# Altium project Merigold.PrjPcb
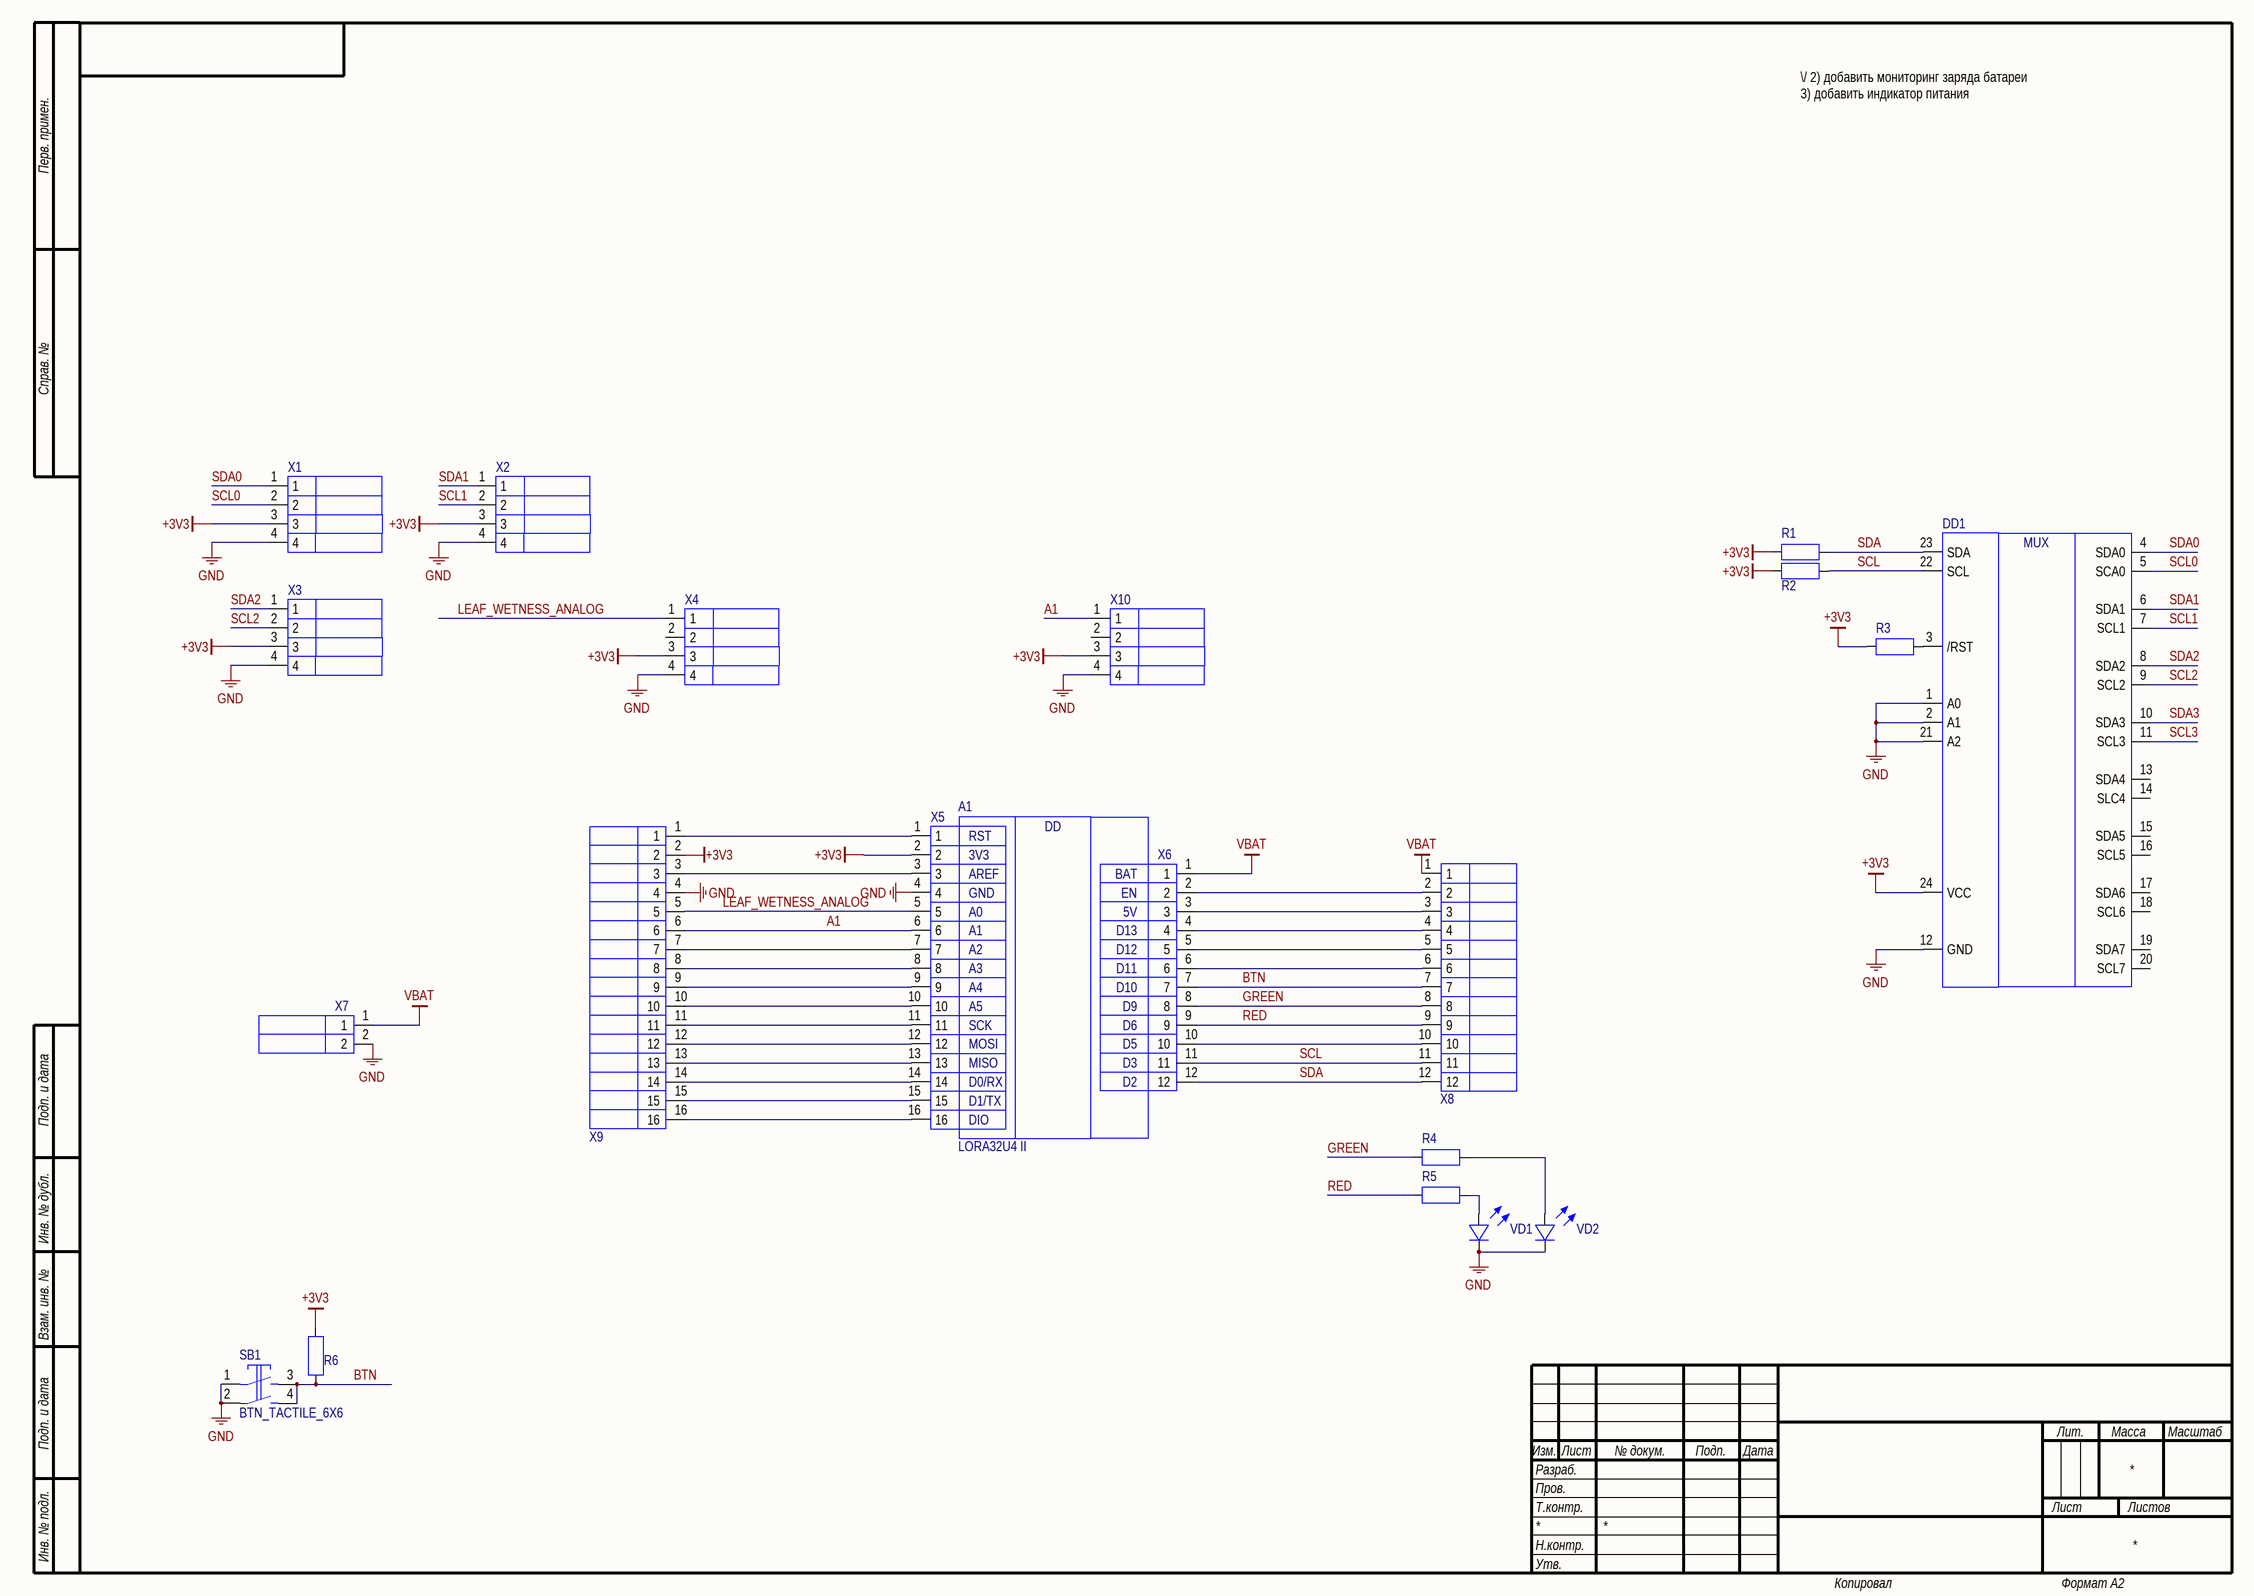
[diagram p0: merigold.SchDoc]
1 sheet, 21 parts. Net scope: global (net labels, ports and power ports of the same name join across sheets).
Board file: merigold_v3.PcbDoc

## Sheet merigold.SchDoc
size 594 x 420 mm; PageSetup: Record=PageOptions|CenterHorizontal=True|CenterVertical=True|PrintScale=0.94|XCorrection=1.00|YCorrection=1.00|PrintKind=1|BorderSize=5000000|LeftOffset=0|BottomOffset=0|Orientation=1|PaperLength=1000|PaperWidth=1000|Scale=100|PaperSource=7|PrintQuality=-4|MediaType=1|DitherType=10|PaperKind=A4|PrintScaleMode=1; DecimalNumber: Децимальный номер; HeadOfSector: Нач. сектора; MainDevice: Перв.примен.; Name: Наименование

### Parts
A1  LORA32U4 II  [LORA32U4 II]
DD1  TCA9548A  [TSOP65P640X120-24M]  (value not drawn)
R1  10K1206  [RESC3216X07N/1206]  (value not drawn)
R2  10K1206  [RESC3216X07N/1206]  (value not drawn)
R3  10K1206  [RESC3216X07N/1206]  (value not drawn)
R4  200R1206  [RESC3216X07N/1206]  (value not drawn)
R5  200R1206  [RESC3216X07N/1206]  (value not drawn)
R6  10K1206  [RESC3216X07N/1206]  (value not drawn)
SB1  BTN_TACTILE_6X6  [BTN_TACTILE_6X6]
VD1  LED_SSL-LX5093GD-TR26  [LED500]  (value not drawn)
VD2  LED_SSL-LX5093GD-TR26  [LED500]  (value not drawn)
X1  MOLEX_0397000904  [MOLEX_0397000904]  (value not drawn)
X2  MOLEX_0397000904  [MOLEX_0397000904]  (value not drawn)
X3  MOLEX_0397000904  [MOLEX_0397000904]  (value not drawn)
X4  MOLEX_0397000904  [MOLEX_0397000904]  (value not drawn)
X5  PLS_16_FEMALE  [PLS_16_FEMALE]  (value not drawn)
X6  PLS_12_FEMALE  [PLS_12_FEMALE]  (value not drawn)
X7  2EDGV-5.0-02P  [2EDGV-5.0-02P]  (value not drawn)
X8  PLS_12_FEMALE  [PLS_12_FEMALE]  (value not drawn)
X9  PLS_16_FEMALE  [PLS_16_FEMALE]  (value not drawn)
X10  MOLEX_0397000904  [MOLEX_0397000904]  (value not drawn)

### Nets
+3V3: DD1.24(VCC) R1.2 R2.2 R3.2 R6.2 X1.3 X2.3 X3.3 X4.3 X5.2 X9.2 X10.3
GND: DD1.1(A0) DD1.2(A1) DD1.12(GND) DD1.21(A2) SB1.1 SB1.2 VD1.K VD2.K X1.4 X2.4 X3.4 X4.4 X5.4 X7.2 X9.4 X10.4
VBAT: X6.1 X7.1 X8.1
A1: X5.6 X9.6 X10.1
BTN: R6.1 SB1.3 SB1.4 X6.7 X8.7
GREEN: R4.2 X6.8 X8.8
LEAF_WETNESS_ANALOG: X4.1 X5.5 X9.5
RED: R5.2 X6.9 X8.9
SCL: DD1.22(SCL) R2.1 X6.11 X8.11
SCL0: DD1.5(SCA0) X1.2
SCL1: DD1.7(SCL1) X2.2
SCL2: DD1.9(SCL2) X3.2
SCL3: DD1.11(SCL3)
SDA: DD1.23(SDA) R1.1 X6.12 X8.12
SDA0: DD1.4(SDA0) X1.1
SDA1: DD1.6(SDA1) X2.1
SDA2: DD1.8(SDA2) X3.1
SDA3: DD1.10(SDA3)
NetDD1_3: DD1.3(/RST) R3.1
NetR4_1: R4.1 VD2.A
NetR5_1: R5.1 VD1.A
NetX5_1: X5.1 X9.1
NetX5_3: X5.3 X9.3
NetX5_7: X5.7 X9.7
NetX5_8: X5.8 X9.8
NetX5_9: X5.9 X9.9
NetX5_10: X5.10 X9.10
NetX5_11: X5.11 X9.11
NetX5_12: X5.12 X9.12
NetX5_13: X5.13 X9.13
NetX5_14: X5.14 X9.14
NetX5_15: X5.15 X9.15
NetX5_16: X5.16 X9.16
NetX6_2: X6.2 X8.2
NetX6_3: X6.3 X8.3
NetX6_4: X6.4 X8.4
NetX6_5: X6.5 X8.5
NetX6_6: X6.6 X8.6
NetX6_10: X6.10 X8.10

Not connected (* = marked no-connect by the designer): DD1 13(SDA4) 14(SLC4) 15(SDA5) 16(SCL5) 17(SDA6) 18(SCL6) 19(SDA7) 20(SCL7); X4 2; X10 2

### Notes on the sheet
- \/ 2) добавить мониторинг заряда батареи
  3) добавить индикатор питания
- Перв. примен.
- Справ. №
- Подп. и дата
- Инв. № дубл.
- Взам. инв. №
- Разраб.
- Изм.
- Лист
- № докум.
- Подп.
- Дата
- Лит.
- Масса
- Масштаб
- Пров.
- Т.контр.
- Листов
- Инв. № подл.
- Утв.
- Н.контр.
- Копировал
- Формат А2
- (in symbol LORA32U4 II) RST; DD; 3V3; AREF; BAT; GND; EN; A0; 5V; D13; A2; D12; A3; D11; A4; D10; A5; D9; SCK; D6; MOSI; D5; MISO; D3; D0/RX; D2; D1/TX; DIO
- (in symbol TCA9548A) MUX

### Library data of the parts
A1 = LORA32U4 II: LORA 32U4 II 868MHZ; Manufacturer: BSFrance; Manufacturer Part Number: Lora32U4 II ver 1.2; TH: 1
DD1 = TCA9548A: IC I2C SW 8CH W/RESET 24TSSOP; Manufacturer: Texas Instruments; Manufacturer Part Number: TCA9548APWR
R1-R3 R6 = 10K1206: RES SMD 10K OHM 1% 1/4W 1206; Manufacturer: Panasonic; Manufacturer Part Number: ERJ8ENF1002V; Rated Power: 0.25 W; Resistance: 10 kO; Tolerance (%): ±1 %
R4 R5 = 200R1206: RES SMD 200 OHM 1% 1/4W 1206; Manufacturer Part Number: CRCW1206200RFKEA; Manufacturer: Vishay Dale
SB1 = BTN_TACTILE_6X6: SWITCH TACTILE SPST-NO 0.05A 24V; Manufacturer: TE Connectivity Alcoswitch; Manufacturer Part Number: 1825910-6; Pole Throw Configuration: SPST
VD1 VD2 = LED_SSL-LX5093GD-TR26: LED GREEN DIFFUSED T-1 3/4 T/H; Manufacturer: Lumex; Manufacturer Part Number: SSL-LX5093GD-TR26
X1-X4 X10 = MOLEX_0397000904: TERM BLK 4POS TOP ENTRY 5MM PCB; Manufacturer: Molex; Supplier 1: Digi-Key; Manufacturer Part Number: 0397000904; Supplier Part Number 1: WM10641-ND
X5 X9 = PLS_16_FEMALE: CONN RCPT 16POS 0.1 GOLD PCB; Manufacturer: TE Connectivity AMP Connectors; Manufacturer Part Number: 1-534237-4; TH: 1
X6 X8 = PLS_12_FEMALE: CONN RCPT 12POS 0.1 GOLD PCB; Manufacturer: TE Connectivity AMP Connectors; Manufacturer Part Number: 1-534237-0; TH: 1
X7 = 2EDGV-5.0-02P: TERM BLOCK HDR 2POS VERT 5MM; Manufacturer: Phoenix Contact; Manufacturer Part Number: 1753437

## Assembly variants
Variant of Merigold: all parts fitted